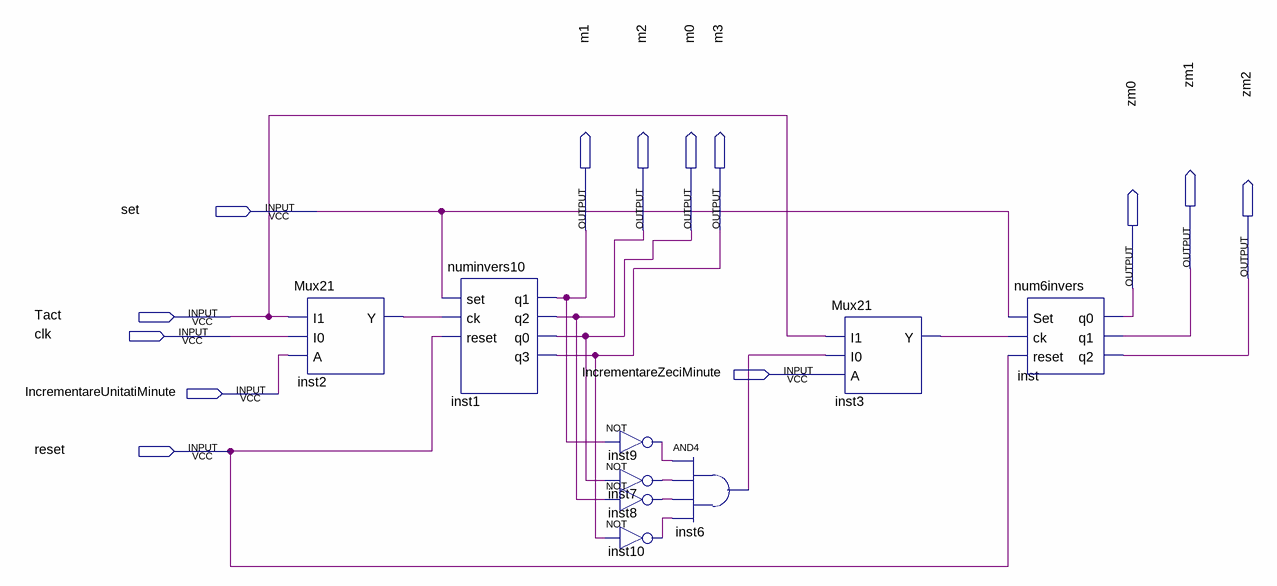
[diagram p0: schematic sheet]
// Quartus schematic numaratorminute.bdf as structural Verilog: 9 symbols, 13 pins
module numaratorminute (
  input  set,
  input  Tact,
  input  clk,
  input  IncrementareZeciMinute,
  input  IncrementareUnitatiMinute,
  input  reset,
  output m1,
  output m2,
  output m0,
  output m3,
  output zm1,
  output zm2,
  output zm0
);

  wire inst2_y, inst3_y, inst6_out, inst7_out, inst8_out, inst9_out, inst10_out;

  Mux21 inst2 (.I1(Tact), .I0(clk), .A(IncrementareUnitatiMinute), .Y(inst2_y));
  numinvers10 inst1 (.set(set), .ck(inst2_y), .reset(reset), .q1(m1), .q2(m2), .q0(m0), .q3(m3));
  not inst9 (inst9_out, m1);
  not inst7 (inst7_out, m0);
  not inst8 (inst8_out, m2);
  not inst10 (inst10_out, m3);
  and inst6 (inst6_out, inst9_out, inst7_out, inst8_out, inst10_out);
  Mux21 inst3 (.I1(Tact), .I0(inst6_out), .A(IncrementareZeciMinute), .Y(inst3_y));
  num6invers inst (.Set(set), .ck(inst3_y), .reset(reset), .q0(zm0), .q1(zm1), .q2(zm2));
endmodule
